# EAGLE schematic emonDCduo-ESP v1.4 (EAGLE 7.7.0)
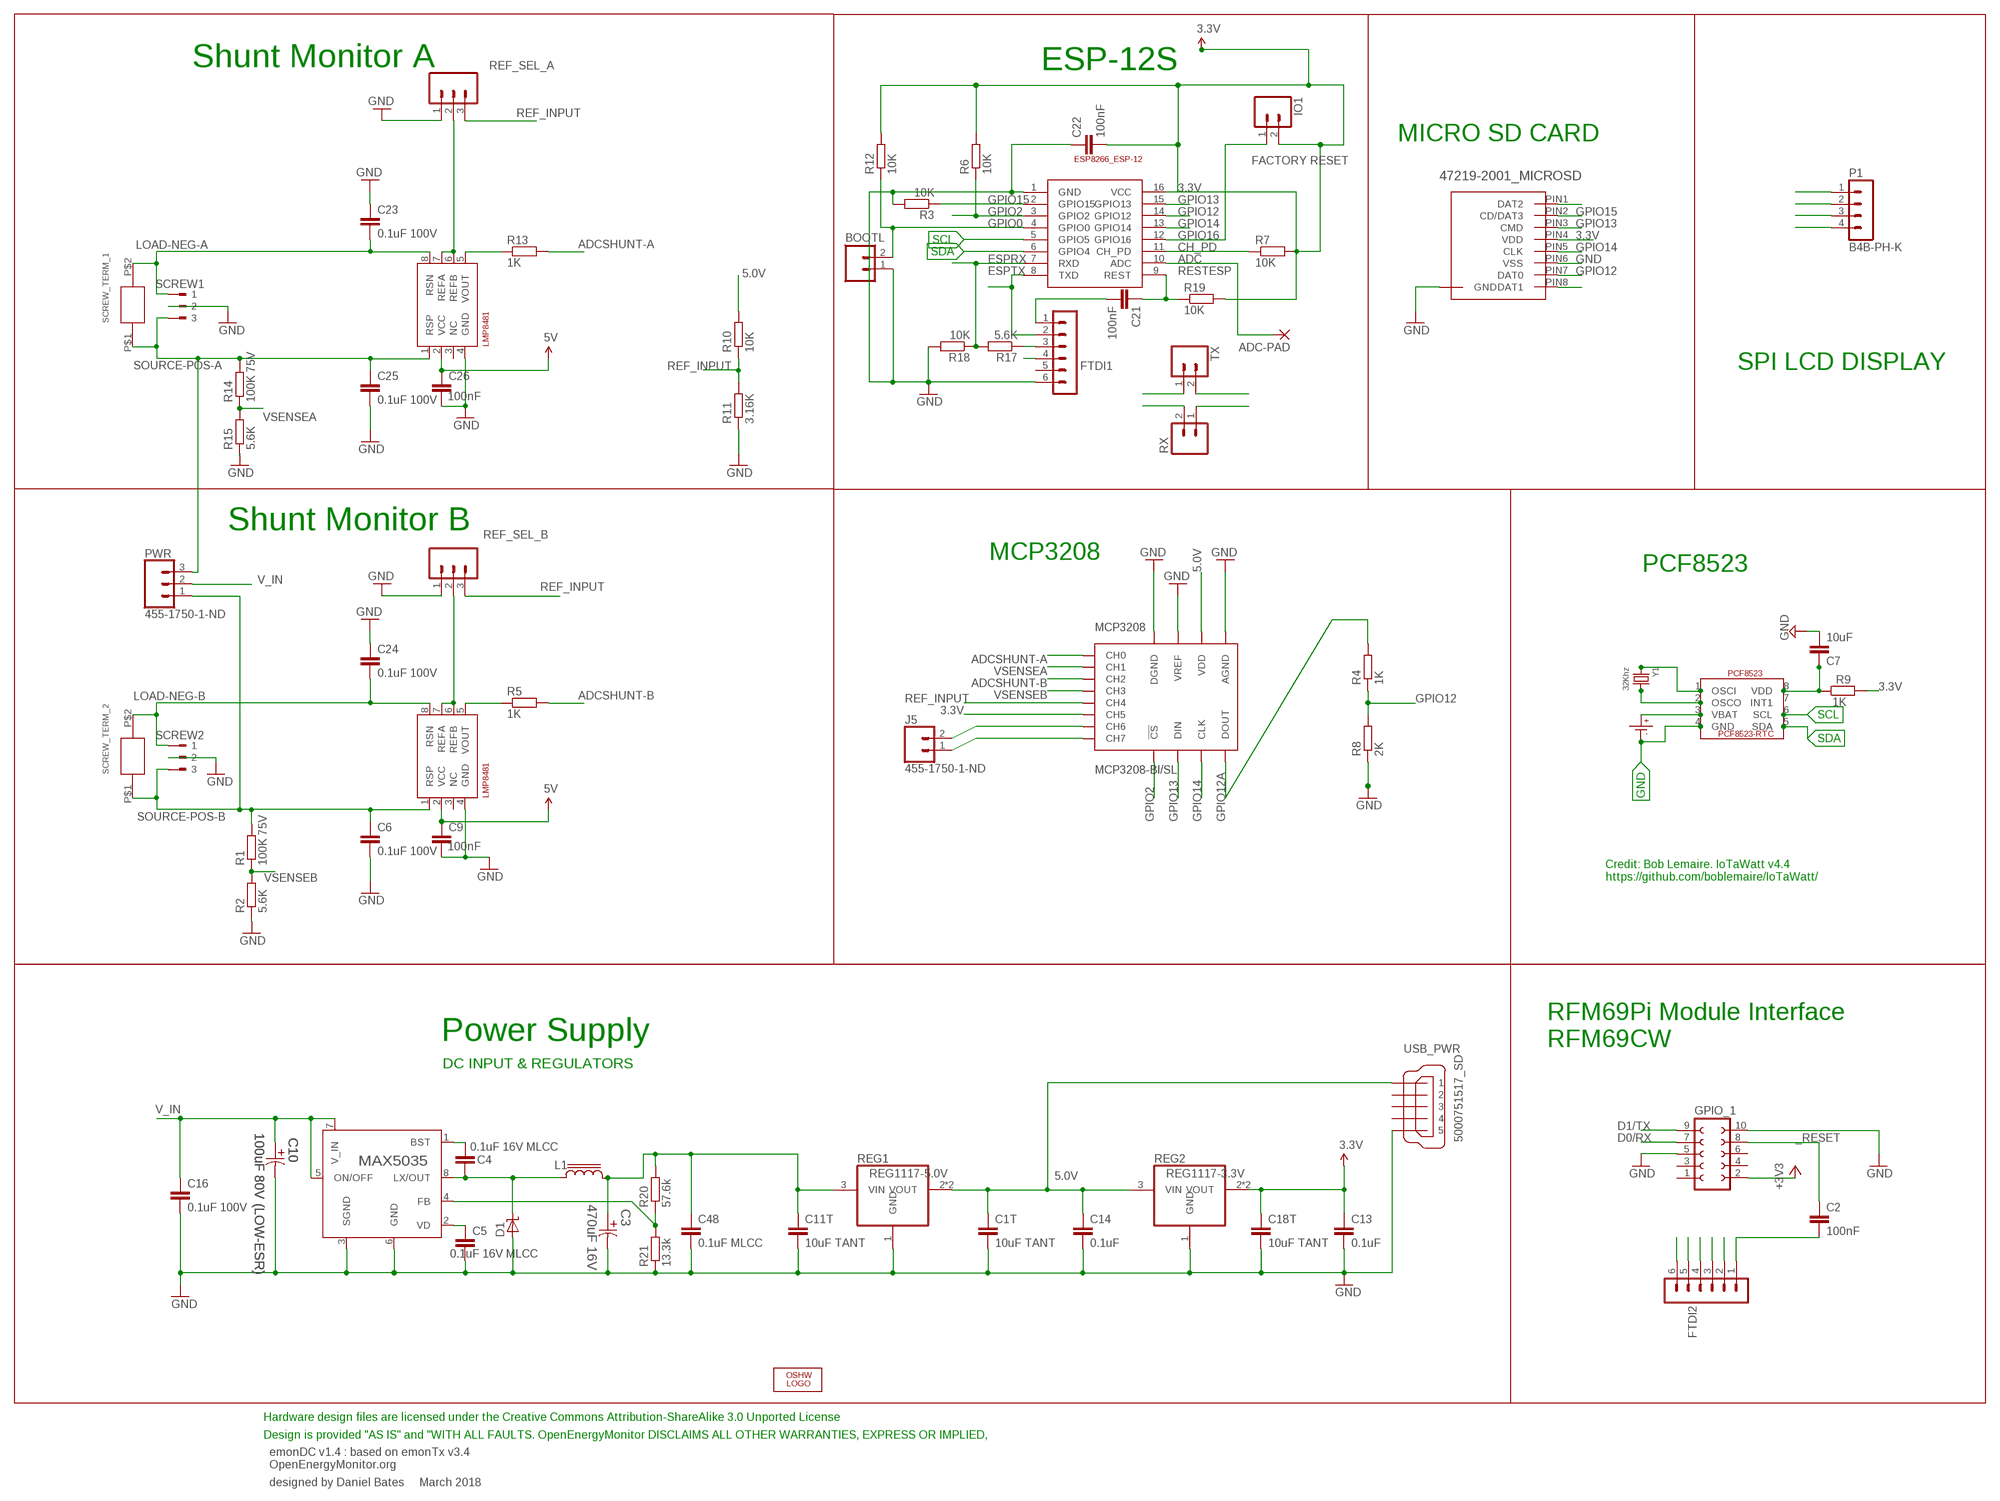
[diagram p0: schematic, sheet 1]

## Parts
ADC-PAD  2,15/1,0  [2,15/1,0]
BOOTL  M02PTH  [1X02]
C1T  10uF TANT  C-EUC0603  [C0603]
C2  100nF  C-EUC0603  [C0603]
C3  470uF 16V  EEE-FK1C471P-CASE-F  [CAPAE830X1050N]
C4  0.1uF 16V MLCC  C-EUC0603  [C0603]
C5  0.1uF 16V MLCC  C-EUC0603  [C0603]
C6  0.1uF 100V  C-EUC0603  [C0603]
C7  10uF  C-EUC0603  [C0603]
C9  100nF  C-EUC0603  [C0603]
C10  100uF 80V (LOW-ESR)  EEV-FK1K101Q-CASE-H13  [CAPAE1350X1400N]
C11T  10uF TANT  C-EUC0603  [C0603]
C13  0.1uF  C-EUC0603  [C0603]
C14  0.1uF  C-EUC0603  [C0603]
C16  0.1uF 100V  C-EUC0603  [C0603]
C18T  10uF TANT  C-EUC0603  [C0603]
C21  100nF  C-EUC0603  [C0603]
C22  100nF  C-EUC0603  [C0603]
C23  0.1uF 100V  C-EUC0603  [C0603]
C24  0.1uF 100V  C-EUC0603  [C0603]
C25  0.1uF 100V  C-EUC0603  [C0603]
C26  100nF  C-EUC0603  [C0603]
C48  0.1uF MLCC  C-EUC0603  [C0603]
CR1220  CR1220SMD  [CR1220SMD]
D1  MBRS1100T3G  [SMB_1]
ESP-12  ESP8266_ESP-12  [ESP8266-ESP12]
FTDI1  FTDI  MA06-1  [MA06-1]
FTDI2  FTDI  MA06-1  [MA06-1]
GPIO_1  FE05-2  [FE05-2]
IO1  M02PTH  [1X02]
J5  455-1750-1-ND  CONN_02  [1X02]
L1  SRR1208  [SSR1208]
LOGO1  OSHW_LOGO_6MILX0200-NT  [OSHW_6X200_NOTEXT]
MCP3208  MCP3208-BI/SL  [SOIC16]
P1  B4B-PH-K  [B4B-PH-K]
PCF8523  PCF8523_RTC  [SOIC_8]
PWR  455-1750-1-ND  CONN_03  [1X03]
R1  100K 75V  R-EU_R0603  [R0603]
R2  5.6K  R-EU_R0603  [R0603]
R3  10K  R-EU_R0603  [R0603]
R4  1K  R-EU_R0603  [R0603]
R5  1K  R-EU_R0603  [R0603]
R6  10K  R-EU_R0603  [R0603]
R7  10K  R-EU_R0603  [R0603]
R8  2K  R-EU_R0603  [R0603]
R9  1K  R-EU_R0603  [R0603]
R10  10K  R-EU_0309/12  [0309/12]
R11  3.16K  R-EU_0309/12  [0309/12]
R12  10K  R-EU_R0603  [R0603]
R13  1K  R-EU_R0603  [R0603]
R14  100K 75V  R-EU_R0603  [R0603]
R15  5.6K  R-EU_R0603  [R0603]
R17  5.6K  R-EU_R0603  [R0603]
R18  10K  R-EU_R0603  [R0603]
R19  10K  R-EU_R0603  [R0603]
R20  57.6k  R-EU_R0603  [R0603]
R21  13.3k  R-EU_R0603  [R0603]
REF_SEL_A  455-1750-1-ND  CONN_03  [1X03]
REF_SEL_B  455-1750-1-ND  CONN_03  [1X03]
REG0  MAX5035  [21-0111D_SBE-14]
REG1  REG1117-5.0V  REG1117-VOUT4  [SOT223]
REG2  REG1117-3.3V  REG1117-VOUT4  [SOT223]
RX  M02PTH  [1X02]
SCREW1  180-3  [180-3]
SCREW2  180-3  [180-3]
SCREW_TERM_1  EBW_SERIES_15.2MM  [EBW_SERIES_15.2MM]
SCREW_TERM_2  EBW_SERIES_15.2MM  [EBW_SERIES_15.2MM]
SHUNTMON-A  LMP8481  LMP8481-H  [S-PDSO-G08]
SHUNTMON-B  LMP8481  LMP8481-H  [S-PDSO-G08]
TX  M02PTH  [1X02]
U$4  47219-2001_MICROSD  [47219-2001_MICROSD]
USB_PWR  5000751517_SD  [5000751517_SD]
Y1  32Khz  CRYSTAL8X3.8SMT  [CRYSTAL_8X3.8]

## Nets
3.3V: C13.1 C18T.1 C22.2 ESP-12.16(VCC) GPIO_1.2 IO1.2 MCP3208.6(CH5) P1.3 R6.2 R7.2 R9.2 R12.2 R19.2 REG2.2(VOUT) REG2.4(VOUT) U$4.PIN4(VDD) ; supply symbol labelled +3V3
5.0V [power]: C1T.1 C9.1 C14.1 C26.1 FTDI1.4 FTDI2.4 MCP3208.16(VDD) R10.2 REG1.2(VOUT) REG1.4(VOUT) REG2.3(VIN) SHUNTMON-A.2(VCC) SHUNTMON-B.2(VCC) USB_PWR.VBUS ; supply symbol labelled 5V
6.5V: C3.1 C11T.1 C48.1 L1.2 R20.2 REG1.3(VIN)
_RESET: C2.1 GPIO_1.8
ADC: ADC-PAD.1(P) ESP-12.10(ADC)
ADCSHUNT-A: MCP3208.1(CH0) R13.2
ADCSHUNT-B: MCP3208.3(CH2) R5.2
BST: C4.1 REG0.1(BST)
CH6: J5.2 MCP3208.7(CH6)
CH7: J5.1 MCP3208.8(CH7)
CH_PD: ESP-12.11(CH_PD) R7.1
D0/RX: FTDI2.2 GPIO_1.7 TX.2
D1/TX: FTDI2.3 GPIO_1.9 RX.1
ESPRX: ESP-12.7(RXD) R17.2 R18.1 RX.2
ESPTX: ESP-12.8(TXD) FTDI1.2 TX.1
FB: R20.1 R21.2 REG0.4(FB)
GND [thin_power]: BOOTL.1 C1T.2 C3.2 C5.2 C6.2 C7.2 C9.2 C10.2 C11T.2 C13.2 C14.2 C16.2 C18T.2 C22.1 C23.1 C24.1 C25.2 C26.2 C48.2 CR1220.P-(P$-) D1.A ESP-12.1(GND) FTDI1.6 FTDI2.6 GPIO_1.5 GPIO_1.10 MCP3208.9(DGND) MCP3208.14(AGND) MCP3208.15(VREF) P1.4 PCF8523.4(GND) R2.1 R3.2 R8.1 R11.1 R15.1 R18.2 R21.1 REF_SEL_A.1 REF_SEL_B.1 REG0.3(SGND) REG0.6(GND) REG1.1(GND) REG2.1(GND) SCREW1.2 SCREW2.2 SHUNTMON-A.4(GND) SHUNTMON-B.4(GND) U$4.P$1(GND) U$4.P$2(GND) U$4.P$3(GND) U$4.P$4(GND) U$4.PIN6(VSS) USB_PWR.GND1 USB_PWR.GND2 USB_PWR.GND3
GPIO0: BOOTL.2 ESP-12.4(GPIO0) R12.1
GPIO2: ESP-12.3(GPIO2) MCP3208.10(!CS) R6.1
GPIO12: ESP-12.14(GPIO12) R4.1 R8.2 U$4.PIN7(DAT0)
GPIO12A: MCP3208.12(DOUT) R4.2
GPIO13: ESP-12.15(GPIO13) MCP3208.11(DIN) U$4.PIN3(CMD)
GPIO14: ESP-12.13(GPIO14) MCP3208.13(CLK) U$4.PIN5(CLK)
GPIO15 [thin_power]: ESP-12.2(GPIO15) R3.1 U$4.PIN2(CD/DAT3)
GPIO16: ESP-12.12(GPIO16) IO1.1
LOAD-NEG-A: C23.2 SCREW1.1 SCREW_TERM_1.P$2 SHUNTMON-A.8(RSN)
LOAD-NEG-B: C24.2 SCREW2.1 SCREW_TERM_2.P$2 SHUNTMON-B.8(RSN)
LX: C4.2 D1.C L1.1 REG0.8(LX/OUT)
N$4: R13.1 SHUNTMON-A.5(VOUT)
N$6: R5.1 SHUNTMON-B.5(VOUT)
N$7: U$4.PIN1(DAT2)
N$10: C7.1 PCF8523.8(VDD) R9.1
N$20: FTDI2.5
N$30: C21.2 FTDI1.1
N$32: U$4.PIN8(DAT1)
N$36: FTDI1.3 R17.1
N$43: CR1220.P+(P$+) PCF8523.3(VBAT)
N$44: PCF8523.2(OSCO) Y1.P$4
N$45: PCF8523.1(OSCI) Y1.P$1
N$301: C2.2 FTDI2.1
REF_A_INPUT: REF_SEL_A.2 SHUNTMON-A.6(REFB) SHUNTMON-A.7(REFA)
REF_B_INPUT [thin_power]: REF_SEL_B.2 SHUNTMON-B.6(REFB) SHUNTMON-B.7(REFA)
REF_INPUT: MCP3208.5(CH4) R10.1 R11.2 REF_SEL_A.3 REF_SEL_B.3
RESTESP: C21.1 ESP-12.9(REST) R19.1
SCL: ESP-12.5(GPIO5) P1.2 PCF8523.6(SCL)
SDA: ESP-12.6(GPIO4) P1.1 PCF8523.5(SDA)
SOURCE-POS-A: C25.1 PWR.3 R14.2 SCREW1.3 SCREW_TERM_1.P$1 SHUNTMON-A.1(RSP)
SOURCE-POS-B: C6.1 PWR.1 R1.2 SCREW2.3 SCREW_TERM_2.P$1 SHUNTMON-B.1(RSP)
V_IN: C10.1 C16.1 PWR.2 REG0.5(ON/OFF) REG0.7(V_IN)
VD: C5.1 REG0.2(VD)
VSENSEA: MCP3208.2(CH1) R14.1 R15.2
VSENSEB: MCP3208.4(CH3) R1.1 R2.2
Unconnected: FTDI1.5 GPIO_1.1 GPIO_1.3 GPIO_1.4 GPIO_1.6 PCF8523.7(INT1) SHUNTMON-A.3(NC) SHUNTMON-B.3(NC) USB_PWR.D+ USB_PWR.D- USB_PWR.ID

## Notes on the sheet
- Shunt Monitor A | ESP-12S
- MICRO SD CARD
- FACTORY RESET
- SPI LCD DISPLAY
- Shunt Monitor B
- MCP3208
- PCF8523
- Credit: Bob Lemaire. IoTaWatt v4.4
  https://github.com/boblemaire/IoTaWatt/
- Power Supply
- RFM69Pi Module Interface
  RFM69CW
- DC INPUT & REGULATORS
- Hardware design files are licensed under the Creative Commons Attribution-ShareAlike 3.0 Unported License
- Design is provided "AS IS" and "WITH ALL FAULTS. OpenEnergyMonitor DISCLAIMS ALL OTHER WARRANTIES, EXPRESS OR IMPLIED,
- emonDC v1.4 : based on emonTx v3.4
  OpenEnergyMonitor.org
- designed by Daniel Bates     March 2018

## Library data of the parts
ADC-PAD = wirepad:2,15/1,0: THROUGH-HOLE PAD
BOOTL IO1 RX TX = SparkFun:M02: Header 2 Standard 2-pin 0.1" header. Use with straight break away headers (SKU : PRT-00116), right angle break away headers (PRT-00553), swiss pins (PRT-00743), machine pins (PRT-00117), and female headers (PRT-00115). Molex polarized connector foot print use with SKU : PRT-08233 with associated crimp pins and housings.
C1T C2 C4 C5 C11T C13 C14 C16 C18T C21 C22 C48 = rcl:C-EU: CAPACITOR, European symbol
C3 = Panasonic-EEEFK_EEEFP:EEE-: Aluminum Electrolytic Capacitors,Surface Mount Type; MPN: EEE-FK1C471P; OC_FARNELL: 9695710; OC_NEWARK: 96K9385; PACKAGE: CASE-F; SUPPLIER: PANASONIC; TOLERANCE: ±20 %; VALUE: 470UF; VOLTAGERATING: 16V
C6 C9 C23-C26 = rcl:C-EU: CAPACITOR, European symbol; MPN: C1608X7S2A104K080AB
C7 = rcl@1:C-EU: CAPACITOR, European symbol
C10 = Panasonic-EEE-EEV-EEF-ECQ:EEV-: Aluminum Electrolytic Capacitors,Surface Mount Type; MPN: EEVFK1K101Q; OC_FARNELL: 9696113; OC_NEWARK: 96K9484; SUPPLIER: PANASONIC; TOLERANCE: ±20 %; VALUE: 100UF; VOLTAGERATING: 80V
CR1220 = IotaWatt_parts:CR1220SMD: CR1220 Battery SMD; MPN: Harwin S8411-45R
D1 = diodes:MBRS1100T3G: MBRS1100T3G 100V 1A Freewheeling Diode; MPN: MBRS1100T3G
ESP-12 = ESP8266-ESP12:ESP8266_ESP-12
FTDI1 FTDI2 = JeeLabs:MA06-1: PIN HEADER
GPIO_1 = con-lsta:FE05-2: FEMALE HEADER; OC_FARNELL: unknown; OC_NEWARK: unknown
J5 = SparkFun-Connectors:CONN_02: Multi connection point. Often used as Generic Header-pin footprint for 0.1 inch spaced/style header connections On any of the 0.1 inch spaced packages, you can populate with these: Break Away Headers - Straight <https://www.sparkfun.com/products/116> (PRT-00116) Break Away Male Headers - Right Angle <https://www.sparkfun.com/products/553> (PRT-00553) Female Headers <https://www.sparkfun.com/products/115> (PRT-00115) Break Away Headers - Machine Pin <https://www.sparkfun.com/products/117> (PRT-00117) Break Away Female Headers - Swiss Machine Pin <https://www.sparkfun.com/products/743> (PRT-00743) For SCREWTERMINALS and SPRING TERMINALS visit here: Screw Terimnals on SparkFun.com <https://www.sparkfun.com/search/results?term=Screw+Terminals> (5mm/3.5mm/2.54mm spacing) This device is also useful as a general connection point to wire up your design to another part of your project. Our various solder wires solder well into these plated through hole pads. Hook-Up Wire - Assortment (Stranded, 22 AWG) <https://www.sparkfun.com/products/11375> (PRT-11375) Hook-Up Wire - Assortment (Solid Core, 22 AWG) <https://www.sparkfun.com/products/11367> (PRT-11367) View the entire wire category on our website here <https://www.sparkfun.com/categories/141> Special notes: Molex polarized connector foot print use with: PRT-08233 with associated crimp pins and housings. 2.54_SCREWTERM for use with PRT-10571. 3.5mm Screw Terminal footprints for PRT-08084 5mm Screw Terminal footprints for use with PRT-08432
L1 = inductor-bourns:SRR1208: POWER INDUCTOR; MPN: SRR1208-151YL
LOGO1 = ohw-logo:OSHW_LOGO_6MIL; OC_FARNELL: unknown
MCP3208 = MCP3208:MCP3208
P1 = jst-ph:B4B-PH-K: HEADER
PCF8523 = IotaWatt_parts:PCF8523_RTC: PCF8523-RTC SOIC-8
PWR = SparkFun-Connectors:CONN_03: Multi connection point. Often used as Generic Header-pin footprint for 0.1 inch spaced/style header connections On any of the 0.1 inch spaced packages, you can populate with these: Break Away Headers - Straight <https://www.sparkfun.com/products/116> (PRT-00116) Break Away Male Headers - Right Angle <https://www.sparkfun.com/products/553> (PRT-00553) Female Headers <https://www.sparkfun.com/products/115> (PRT-00115) Break Away Headers - Machine Pin <https://www.sparkfun.com/products/117> (PRT-00117) Break Away Female Headers - Swiss Machine Pin <https://www.sparkfun.com/products/743> (PRT-00743) Stackable Header - 3 Pin (Female, 0.1") <https://www.sparkfun.com/products/13875> (PRT-13875) For SCREWTERMINALS and SPRING TERMINALS visit here: Screw Terimnals on SparkFun.com <https://www.sparkfun.com/search/results?term=Screw+Terminals> (5mm/3.5mm/2.54mm spacing) This device is also useful as a general connection point to wire up your design to another part of your project. Our various solder wires solder well into these plated through hole pads. Hook-Up Wire - Assortment (Stranded, 22 AWG) <https://www.sparkfun.com/products/11375> (PRT-11375) Hook-Up Wire - Assortment (Solid Core, 22 AWG) <https://www.sparkfun.com/products/11367> (PRT-11367) View the entire wire category on our website here <https://www.sparkfun.com/categories/141> Special notes: Molex polarized connector foot print use with SKU : PRT-08232 with associated crimp pins and housings.; PROD_ID: XXX-00000
R1 R14 = rcl:R-EU_: RESISTOR, European symbol; MPN: MCWR06X1003FTL
R2 R4 R8 R15 = rcl:R-EU_: RESISTOR, European symbol; MPN: MCWR06X5901FTL
R3 R5-R7 R12 R13 R17-R19 = rcl:R-EU_: RESISTOR, European symbol
R9-R11 R20 R21 = rcl@1:R-EU_: RESISTOR, European symbol
REF_SEL_A REF_SEL_B = SparkFun-Connectors:CONN_03: Multi connection point. Often used as Generic Header-pin footprint for 0.1 inch spaced/style header connections On any of the 0.1 inch spaced packages, you can populate with these: Break Away Headers - Straight <https://www.sparkfun.com/products/116> (PRT-00116) Break Away Male Headers - Right Angle <https://www.sparkfun.com/products/553> (PRT-00553) Female Headers <https://www.sparkfun.com/products/115> (PRT-00115) Break Away Headers - Machine Pin <https://www.sparkfun.com/products/117> (PRT-00117) Break Away Female Headers - Swiss Machine Pin <https://www.sparkfun.com/products/743> (PRT-00743) Stackable Header - 3 Pin (Female, 0.1") <https://www.sparkfun.com/products/13875> (PRT-13875) For SCREWTERMINALS and SPRING TERMINALS visit here: Screw Terimnals on SparkFun.com <https://www.sparkfun.com/search/results?term=Screw+Terminals> (5mm/3.5mm/2.54mm spacing) This device is also useful as a general connection point to wire up your design to another part of your project. Our various solder wires solder well into these plated through hole pads. Hook-Up Wire - Assortment (Stranded, 22 AWG) <https://www.sparkfun.com/products/11375> (PRT-11375) Hook-Up Wire - Assortment (Solid Core, 22 AWG) <https://www.sparkfun.com/products/11367> (PRT-11367) View the entire wire category on our website here <https://www.sparkfun.com/categories/141> Special notes: Molex polarized connector foot print use with SKU : PRT-08232 with associated crimp pins and housings.; MF: MULTICOMP; MPN: 2212S-02SG-85; OC_FARNELL: 1593458; PROD_ID: XXX-00000
REG0 = MAX5035:MAX5035: SWITCHING REGULATOR 5.0V 1.0A; MPN: MAX5035EASA+
REG1 = burr-brown:REG1117-VOUT4: 800mA and 1A Low Dropout (LDO) Positive Regulator 1.8V, 2.5V, 2.85V, 3.3V, 5V, and Adj; MF: TEXAS INSTRUMENTS; MPN: REG1117-5.0; OC_FARNELL: 1097566; OC_NEWARK: 14P6981
REG2 = burr-brown:REG1117-VOUT4: 800mA and 1A Low Dropout (LDO) Positive Regulator 1.8V, 2.5V, 2.85V, 3.3V, 5V, and Adj; MF: TEXAS INSTRUMENTS; MPN: REG1117-3.3; OC_FARNELL: 1097566; OC_NEWARK: 14P6981
SCREW1 SCREW2 = con-weidmueller-sl35:180-3: WEIDMUELLER CLAMP CONNECTOR; OC_FARNELL: unknown; OC_NEWARK: unknown
SCREW_TERM_1 SCREW_TERM_2 = EBW series shunt:EBW_SERIES_15.2MM
SHUNTMON-A = lmp8481b:LMP8481: LMP8481MM-H/NOPB 100V/V; MF: TEXAS INSTRUMENTS; MPN: LMP8481MME-S/NOPB; OC_FARNELL: 2322044
SHUNTMON-B = lmp8481b:LMP8481: LMP8481MM-H/NOPB 100V/V; MF: TEXAS INSTRUMENTS; MPN: LMP8481MME-H/NOPB; OC_FARNELL: 2322044
U$4 = MOLEX 47219-2001:47219-2001_MICROSD
USB_PWR = 5000751517_sd:5000751517_SD
Y1 = microbuilder:CRYSTAL: Crystals HC49UP - Surface Mount Crystal 4.0MHz 18pF +/-30ppm Surface Mount Crystal [Digikey: 535-9857-1-ND] 12.0 MHz Surface Mount Crystal [Digikey: 535-9869-6-ND] 25.0 MHz Surface Mount Crystal [Digikey: 535-9078-1-ND] 2.5 x 2.0mm - MEMs SMT Crystal 16.0 MHz 10pF 20ppm 2.5 x 2.0mm Crystal [Digikey -40-85°C: 535-10923-1-ND] 3.2 x 2.5mm - MEMs SMT Crystal 12.0 MHz 8pF 15ppm 3.2 x 2.5mm Crystal [Digikey: -10-70°C: 644-1047-1-ND -40-125°C: 644-1128-1-ND] 16.0 MHz 8pF 15ppm 3.2 x 2.5mm Crystal [Digikey: -10-70°C: 644-1049-1-ND -40-125°C: 644-1129-2-ND] 16.0 MHz 10pF 10ppm 3.2 x 2.5mm Crystal [Digikey: 644-1100-1-ND] 27.12 MHz 18pF 30ppm 3.2 x 2.5mm Crystal [Digikey: 887-1424-1-ND] 27.12MHz 10pF 10ppm 3.2 x 2.5mm Crystal [Digikey: 887-1329-1-ND] 4.9 x 1.8mm - MEMs SMT Crystal 32.768 KHz 12.5pF 20ppm 4.9 x 1.8mm Crystal [Digikey: SE2415CT-ND] 8.0 x 3.8mm - Surface Mount Crystal 32.768kHz 12.5pF 20ppm -40°C-85°C [Digikey: 535-9166-2-ND] Cylinder 32.768KHz Cylinder Crystal (2x6mm body) [Ex. Digikey: 300-8341-2-ND]

## Net classes
2 thin_power: width 0.254 mm